# EAGLE design RelayModule4 (EAGLE 5.10)
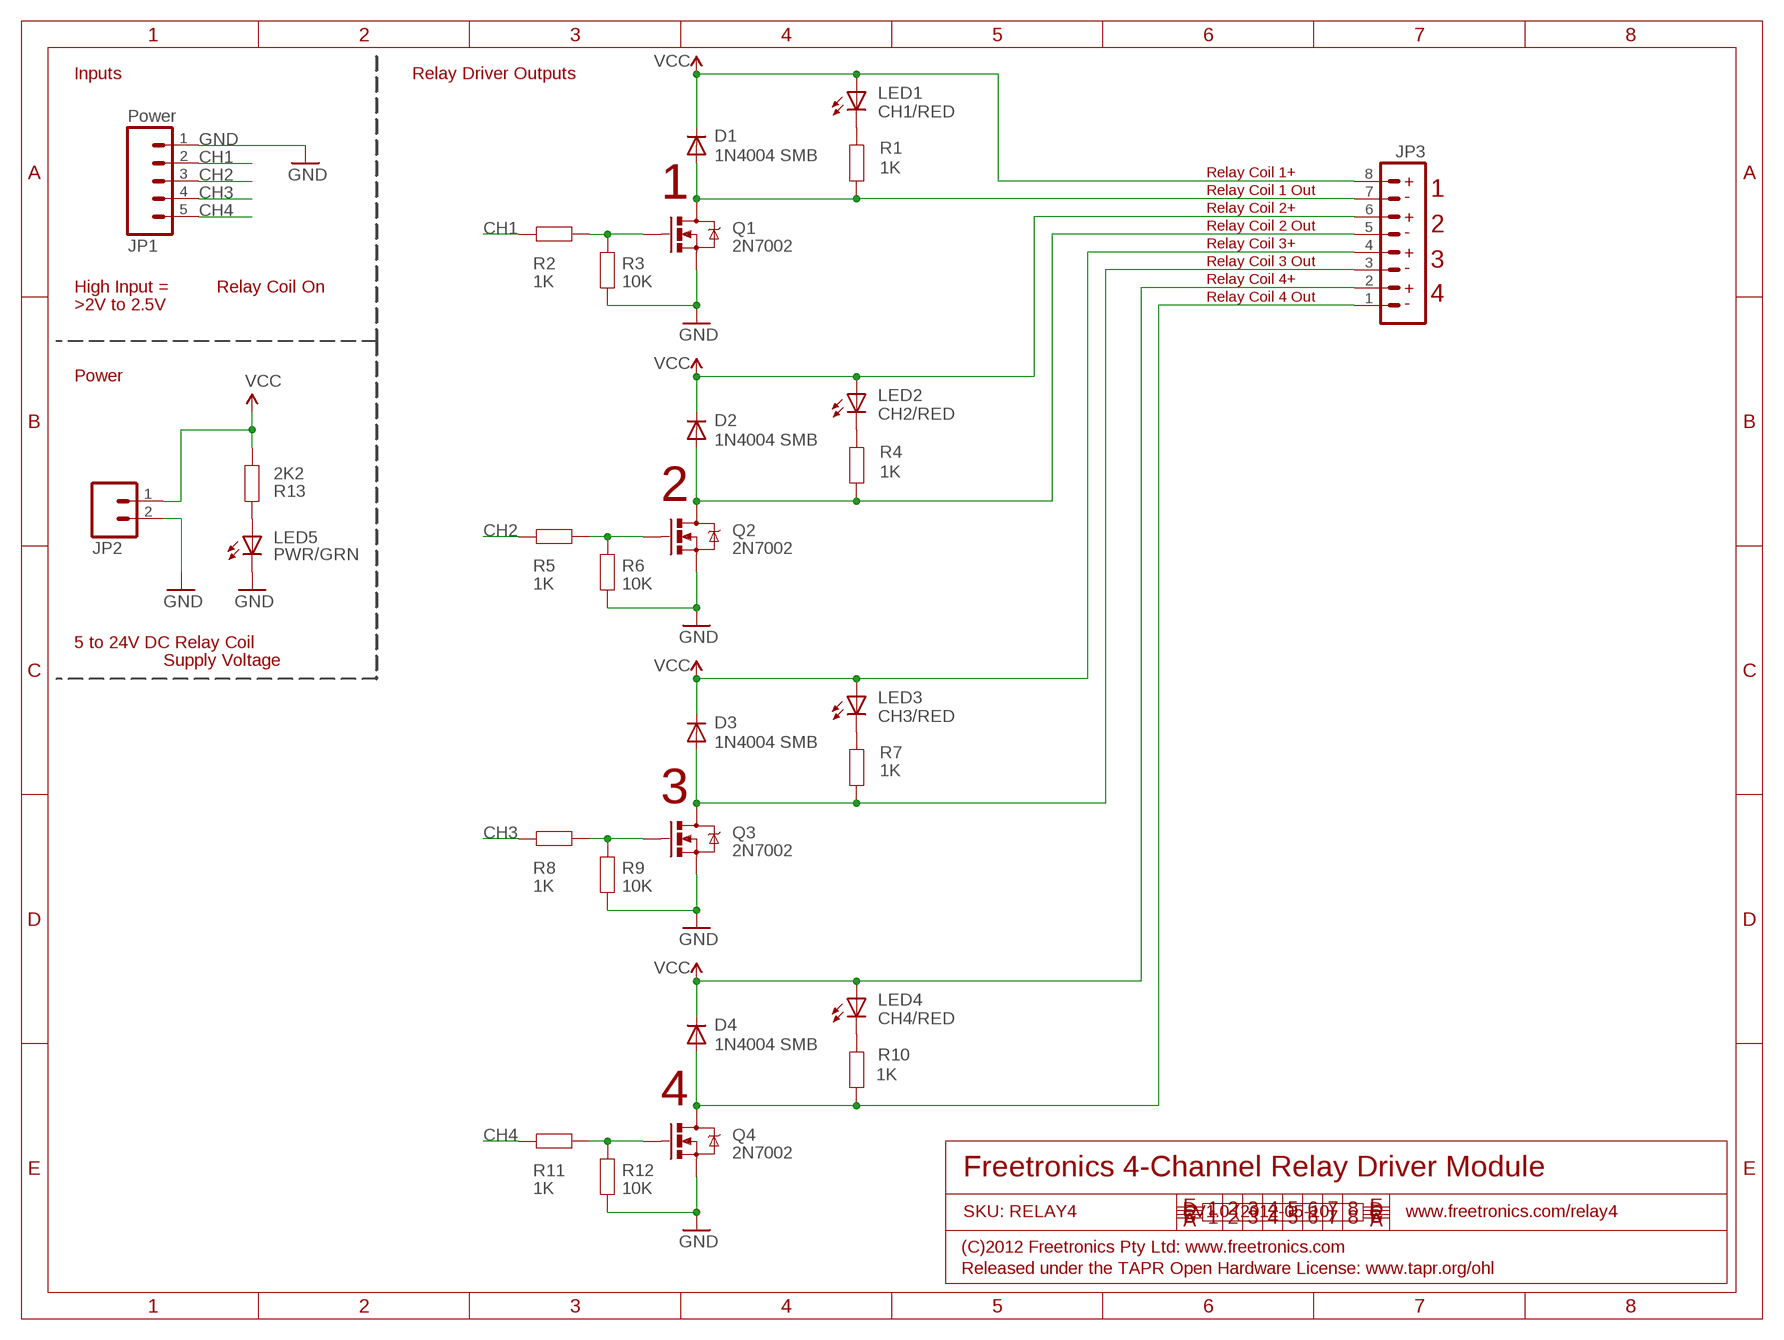
[diagram p0: schematic, sheet 1]

## Parts
D1  1N4004 SMB  DIODESMB  [SMB-DIODE]
D2  1N4004 SMB  DIODESMB  [SMB-DIODE]
D3  1N4004 SMB  DIODESMB  [SMB-DIODE]
D4  1N4004 SMB  DIODESMB  [SMB-DIODE]
JP1  Power  M05PTH  [1X05]
JP2  M023.5MM  [SCREWTERMINAL-3.5MM-2]
JP3  M08  [TERMINALBLOCK_3.5MM_8]
LED1  CH1/RED  LED0603  [LED-0603]
LED2  CH2/RED  LED0603  [LED-0603]
LED3  CH3/RED  LED0603  [LED-0603]
LED4  CH4/RED  LED0603  [LED-0603]
LED5  PWR/GRN  LED0603  [LED-0603]
Q1  2N7002  MOSFET-NCHANNELSMD  [SOT23-3]
Q2  2N7002  MOSFET-NCHANNELSMD  [SOT23-3]
Q3  2N7002  MOSFET-NCHANNELSMD  [SOT23-3]
Q4  2N7002  MOSFET-NCHANNELSMD  [SOT23-3]
R1  1K  RESISTOR0603  [0603]
R2  1K  RESISTOR0603  [0603]
R3  10K  RESISTOR0603  [0603]
R4  1K  RESISTOR0603  [0603]
R5  1K  RESISTOR0603  [0603]
R6  10K  RESISTOR0603  [0603]
R7  1K  RESISTOR0603  [0603]
R8  1K  RESISTOR0603  [0603]
R9  10K  RESISTOR0603  [0603]
R10  1K  RESISTOR0603  [0603]
R11  1K  RESISTOR0603  [0603]
R12  10K  RESISTOR0603  [0603]
R13  2K2  RESISTOR0603  [0603]

## Nets
CH1: JP1.2 R2.2
CH2: JP1.3 R5.2
CH3: JP1.4 R8.2
CH4: JP1.5 R11.2
GND: JP1.1 JP2.2 LED5.C Q1.2(S) Q2.2(S) Q3.2(S) Q4.2(S) R3.1 R6.1 R9.1 R12.1
N$1: Q1.1(G) R2.1 R3.2
N$2: D1.A JP3.7 Q1.3(D) R1.2
N$3: D2.A JP3.5 Q2.3(D) R4.2
N$4: LED5.A R13.1
N$8: Q2.1(G) R5.1 R6.2
N$9: D3.A JP3.3 Q3.3(D) R7.2
N$10: Q3.1(G) R8.1 R9.2
N$11: D4.A JP3.1 Q4.3(D) R10.2
N$12: Q4.1(G) R11.1 R12.2
N$21: LED2.C R4.1
N$22: LED4.C R10.1
N$23: LED3.C R7.1
N$24: LED1.C R1.1
V+: D1.C D2.C D3.C D4.C JP2.1 JP3.2 JP3.4 JP3.6 JP3.8 LED1.A LED2.A LED3.A LED4.A R13.2 ; supply symbol labelled VCC

## Notes on the sheet
- Inputs | Relay Driver Outputs
- Relay Coil 1+
- +
- 1 | Relay Coil 1 Out | 1
- -
- Relay Coil 2+
- +
- Relay Coil 2 Out | 2
- -
- Relay Coil 3+
- +
- Relay Coil 3 Out | 3
- -
- Relay Coil 4+
- High Input = | Relay Coil On | +
- Relay Coil 4 Out | 4
- >2V to 2.5V | -
- Power
- 2
- 5 to 24V DC Relay Coil
- Supply Voltage
- 3
- 4
- Freetronics 4-Channel Relay Driver Module
- SKU: RELAY4 | V1.0 (2012-05-10) | www.freetronics.com/relay4
- (C)2012 Freetronics Pty Ltd: www.freetronics.com
- Released under the TAPR Open Hardware License: www.tapr.org/ohl

## Library data of the parts
D1-D4 = freetronics-master-v1:DIODE: Diode These are standard reverse protection diodes and small signal diodes. SMA package can handle up to about 1A. SOD-323 can handle about 200mA. What the SOD-323 package when ordering, there are some mfgs out there that are 5-pin packages.
JP1 = freetronics-master-v1.1:M05: Header 5 Standard 5-pin 0.1" header. Use with straight break away headers (SKU : PRT-00116), right angle break away headers (PRT-00553), swiss pins (PRT-00743), machine pins (PRT-00117), and female headers (PRT-00115). Molex polarized connector foot print use with SKU : PRT-08230 with associated crimp pins and housings.
JP2 = freetronics-master-v1.1:M02: Header 2 Standard 2-pin 0.1" header. Use with straight break away headers (SKU : PRT-00116), right angle break away headers (PRT-00553), swiss pins (PRT-00743), machine pins (PRT-00117), and female headers (PRT-00115). Molex polarized connector foot print use with SKU : PRT-08233 with associated crimp pins and housings.
JP3 = freetronics-master-v1:M08: Header 8 Standard 8-pin 0.1" header. Use with straight break away headers (SKU : PRT-00116), right angle break away headers (PRT-00553), swiss pins (PRT-00743), machine pins (PRT-00117), and female headers (PRT-00115).
LED1-LED5 = freetronics-master-v1:LED: LEDs Standard schematic elements and footprints for 5mm, 3mm, 1206, and 0603 sized LEDs. 5mm - Spark Fun Electronics SKU : COM-00529 (and others)
Q1-Q4 = freetronics-master-v1:MOSFET-NCHANNEL
R1-R13 = freetronics-master-v1:RESISTOR: Resistor Basic schematic elements and footprints for 0603, 1206, and PTH 1/10th watt (small) resistors.

## Board
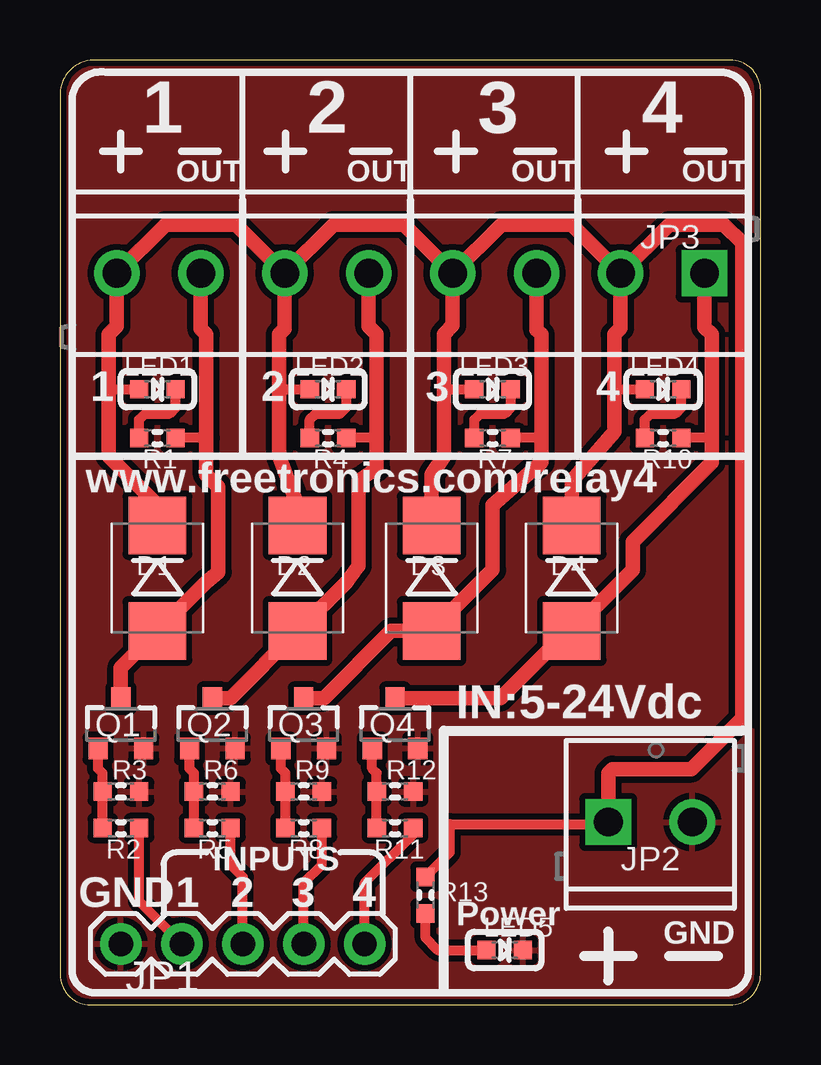
[diagram p1: board, top side]
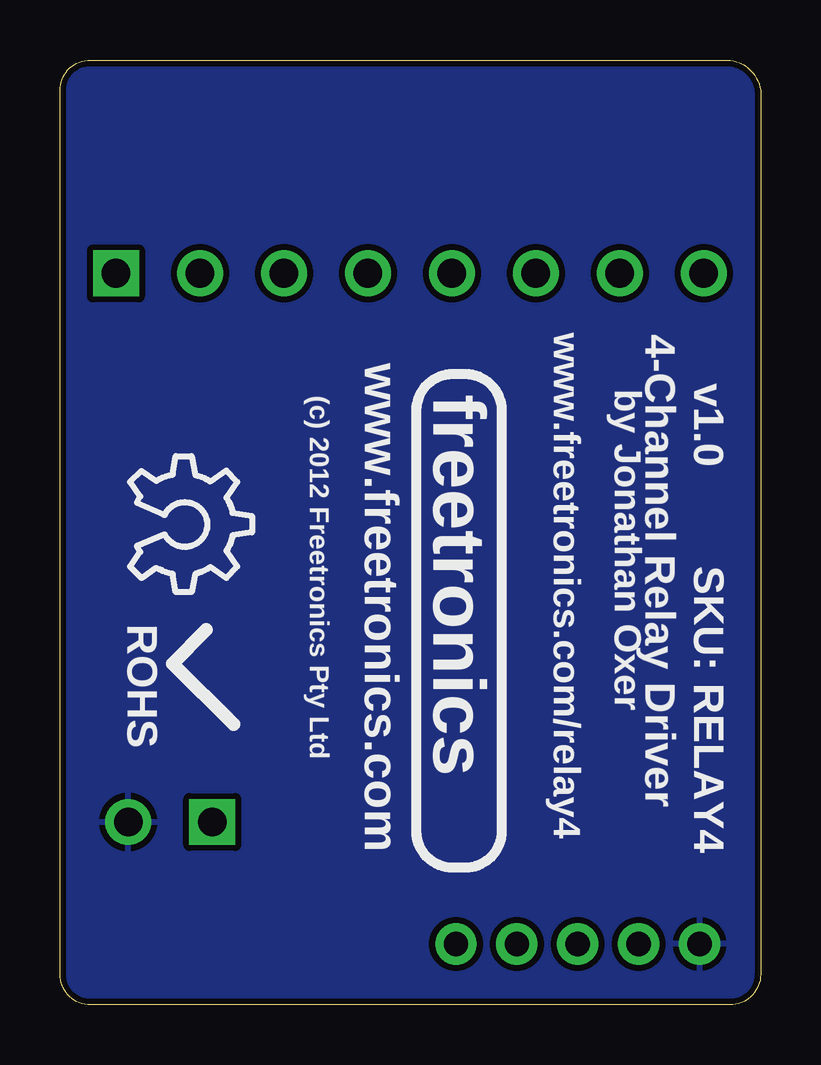
[diagram p2: board, bottom side, seen from below]

Size 29.21 x 39.37 mm. Coordinates in mm from the lower left corner, seen from the top.
Outline: 0,1.27 arc90 1.27,0 27.94,0 arc90 29.21,1.27 29.21,38.1 arc90 27.94,39.37 1.27,39.37 arc74 0,38.1 0,1.27
Copper layers (1*16): Top 0.035mm / dielectric 1.5mm / Bottom 0.035mm
Design rules "default *": minimum track width 10mil, minimum drill 15mil, track to track 10mil, track to pad 10mil, pad to pad 10mil, via to via 10mil, smd to smd 8mil, copper to edge 10mil, drill to drill 8mil, minimum pad ring 14mil, minimum via ring 8mil, stop-mask expansion 4mil, vias tented up to drill 0mil, thermal gap 10mil

### Footprints (pad centres in the part's own frame; a part is rotated, then mirrored left to right if it is on the bottom)
SMB-DIODE = smd 2.4 x 2.4: A 2.2,0; C -2.2,0
1X05 = drill 1.016: 1 0,0; 2 2.54,0; 3 5.08,0; 4 7.62,0; 5 10.16,0
SCREWTERMINAL-3.5MM-2 = drill 1.2 square: 1 0,0 | drill 1.2: 2 3.5,0
TERMINALBLOCK_3.5MM_8 = drill 1.2 square: 1 0,0 | drill 1.2: 2 3.5,0; 3 7,0; 4 10.5,0; 5 14,0; 6 17.5,0; 7 21,0; 8 24.5,0
LED-0603 = smd 0.762 x 0.762: A -0.762,0; C 0.762,0
SOT23-3 = smd 0.8 x 0.9: 1 -0.95,-1; 2 0.95,-1; 3 0,1.1
0603 = smd 0.762 x 0.762: 1 -0.762,0; 2 0.762,0

### Placement (x,y rotation side)
D1  4.06,17.78 270 top
D2  9.91,17.78 270 top
D3  15.49,17.78 270 top
D4  21.34,17.78 270 top
JP1  2.54,2.54 0 top
JP2  22.86,7.62 0 top
JP3  26.87,30.48 180 top
LED1  4.06,25.65 0 top
LED2  11.18,25.65 0 top
LED3  18.03,25.65 0 top
LED4  25.15,25.65 0 top
LED5  18.54,2.29 0 top
Q1  2.54,11.68 0 top
Q2  6.35,11.68 0 top
Q3  10.16,11.68 0 top
Q4  13.97,11.68 0 top
R1  4.06,23.62 0 top
R2  2.54,7.37 0 top
R3  2.54,8.89 180 top
R4  11.18,23.62 0 top
R5  6.35,7.37 0 top
R6  6.35,8.89 180 top
R7  18.03,23.62 0 top
R8  10.16,7.37 0 top
R9  10.16,8.89 180 top
R10  25.15,23.62 0 top
R11  13.97,7.37 0 top
R12  13.97,8.89 180 top
R13  15.24,4.57 90 top
U$5  [OSHW_10X200_NOTEXT]  26.29,22.86 270 bottom

### Tracks (layer width: path | path; a pad name or v marks a point on that pad's centre or on a via)
CH1
  Top 0.406: R2.2 3.3,4.32 JP1.2
CH2
  Top 0.406: R5.2 7.11,5.84 7.62,5.33 JP1.3
CH3
  Top 0.406: R8.2 10.92,5.84 10.16,5.08 JP1.4
CH4
  Top 0.406: R11.2 14.73,7.11 12.7,5.08 JP1.5
GND
  pour Bottom: 0,38.1 arc-74 1.27,39.37 27.94,39.37 arc-74 29.21,38.1 29.21,1.27 arc-90 27.94,0 1.27,0 arc-90 0,1.27
  pour Top: 0,38.1 arc-74 1.27,39.37 27.94,39.37 arc-74 29.21,38.1 29.21,1.27 arc-90 27.94,0 1.27,0 arc-90 0,1.27
N$1
  Top 0.406: R2.1 R3.2 1.78,9.65 1.59,9.84 Q1.1
N$2
  Top 0.406: 6.1,23.62 R1.2
  Top 0.61: D1.A 4.4,15.58 | D1.A 6.1,17.61 6.6,18.03 6.6,21.59 6.1,22.1 6.1,23.62 6.1,27.94 5.87,28.16 JP3.7 | Q1.3 2.54,14.06 D1.A
N$3
  Top 0.406: 13.21,23.62 R4.2
  Top 0.61: JP3.5 12.87,28.27 13.21,27.94 13.21,23.62 13.21,22.35 12.45,21.84 12.45,18.29 11.94,17.61 D2.A 7.11,12.78 Q2.3
N$4
  Top 0.406: LED5.A 15.75,2.29 15.24,2.79 R13.1
N$8
  Top 0.406: Q2.1 5.4,9.84 5.59,9.65 R6.2 R5.1
N$9
  Top 0.406: 20.07,23.62 R7.2
  Top 0.61: JP3.3 19.87,28.13 20.07,27.94 20.07,23.62 20.07,22.61 18.03,20.83 18.03,18.12 D3.A 13.8,15.58 11.01,12.78 Q3.3
N$10
  Top 0.406: Q3.1 9.21,9.84 9.4,9.65 R9.2 R8.1
N$11
  Top 0.406: 27.18,23.62 R10.2
  Top 0.61: Q4.3 18.37,12.78 21.08,15.49 21.25,15.49 D4.A | JP3.1 26.87,28.25 27.18,27.94 27.18,23.62 27.18,22.61 23.88,19.3 23.88,18.12 D4.A | D4.A 21.34,15.49
N$12
  Top 0.406: Q4.1 13.02,9.84 13.21,9.65 R12.2 R11.1
N$21
  Top 0.406: R4.1 10.41,24.38 10.67,24.64 11.68,24.64 11.94,24.89 LED2.C
N$22
  Top 0.406: R10.1 24.38,24.38 24.64,24.64 25.65,24.64 25.91,24.89 LED4.C
N$23
  Top 0.406: R7.1 17.27,24.38 17.53,24.64 18.54,24.64 18.8,24.89 LED3.C
N$24
  Top 0.406: R1.1 3.3,24.38 3.56,24.64 4.57,24.64 4.83,24.89 LED1.C
V+
  Top 0.406: 2.03,25.65 LED1.A | 16,25.65 LED3.A | 23.11,25.65 LED4.A | R13.2 16.26,6.35 16.26,7.53 22.77,7.53 JP2.1 | LED2.A 9.4,25.65 9.14,25.4
  Top 0.61: 4.06,20.32 D1.C 4.06,20.83 2.03,22.86 2.03,25.65 2.03,27.94 2.37,28.28 JP3.8 4.41,32.51 7.34,32.51 JP3.6 | D4.C 21.34,21.84 23.11,23.88 23.11,25.65 23.11,27.94 23.37,28.2 JP3.2 | D3.C 15.49,22.1 16,22.86 16,25.65 16,27.94 16.37,28.31 JP3.4 | D2.C 9.91,20.83 9.14,22.86 9.14,25.4 9.14,27.94 9.37,28.17 JP3.6 | JP3.6 11.4,32.51 14.34,32.51 JP3.4 | JP3.4 18.41,32.51 21.34,32.51 JP3.2 | JP3.2 25.41,32.51 27.69,32.51 28.45,31.75 28.45,11.94 26.33,9.82 23.03,9.82 22.86,9.65 JP2.1

### Text on the board
tPlace: 1 | 2 | 3 | 4 | OUT | OUT | OUT | OUT | 1 | 2 | 3 | 4 | www.freetronics.com/relay4 | IN:5-24Vdc | INPUTS | GND | 1 | 2 | 3 | 4 | Power | GND
bPlace: 4-Channel Relay Driver | www.freetronics.com/relay4 | www.freetronics.com | v1.0 | by Jonathan Oxer | freetronics | (c) 2012 Freetronics Pty Ltd | SKU: RELAY4 | ROHS